# EAGLE schematic powerDistribution (EAGLE 9.5.2)
DATE: Spring'20; REVISION: 1; SCH_DESC: Measures current; Outputs to Teensy or USB; TEAM: RoboWrestling; TITLE: Current Sensing Board
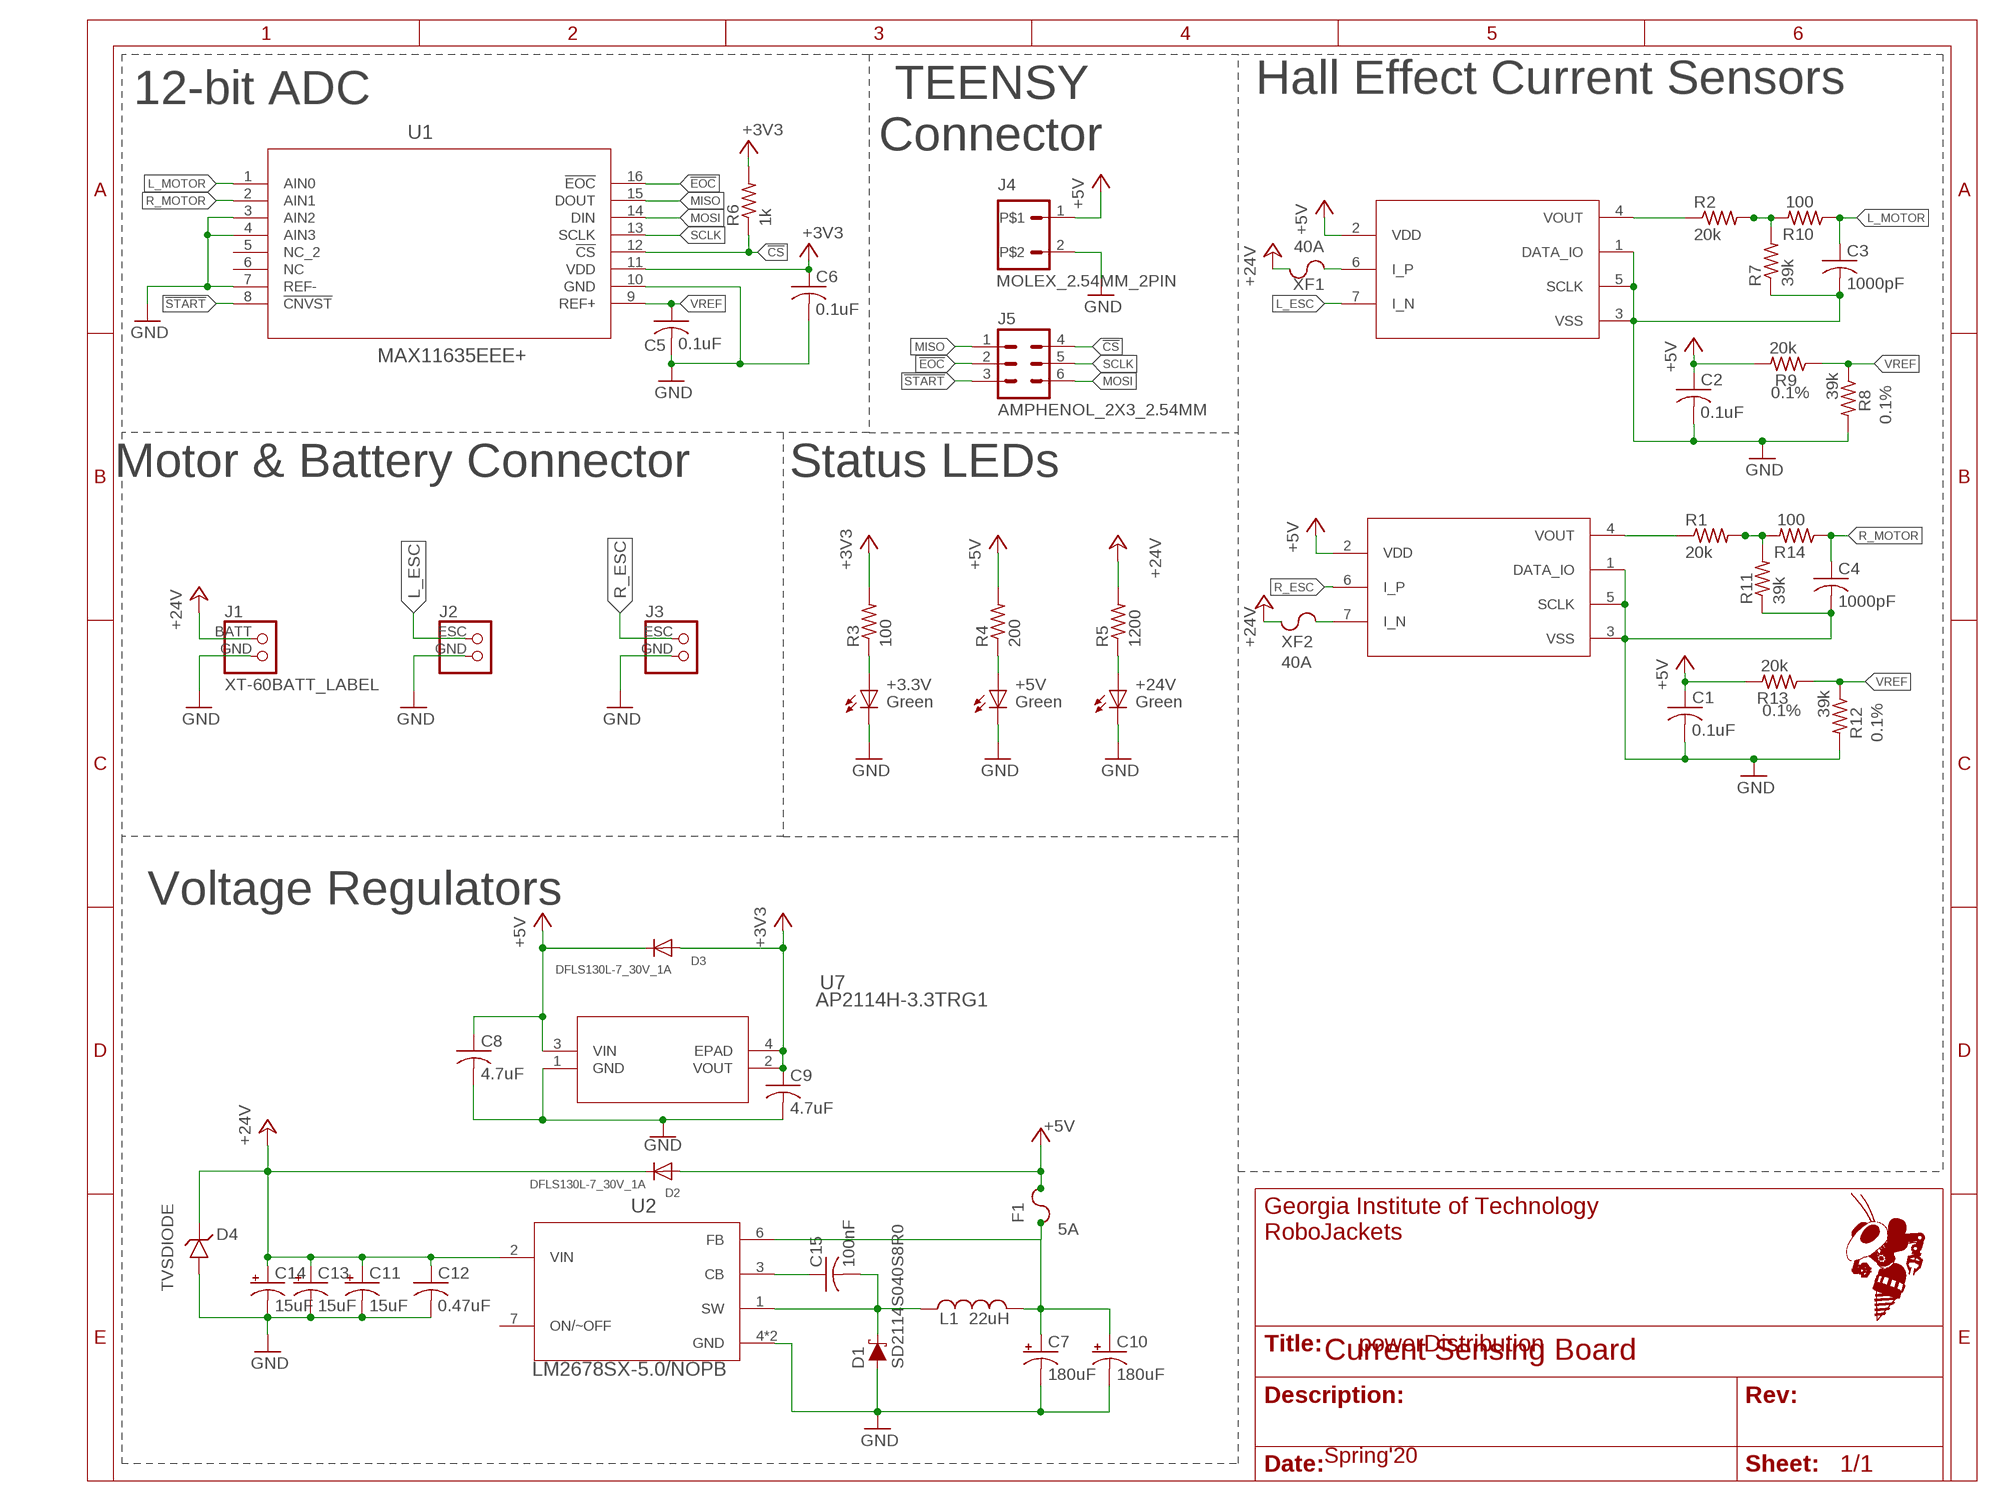
[diagram p0: schematic, sheet 1]

## Parts
+3.3V  Green  LED-SMD  [CHIP-LED0603]
+5V  Green  LED-SMD  [CHIP-LED0603]
+24V  Green  LED-SMD  [CHIP-LED0603]
C1  0.1uF  C-USC0603  [C0603]
C2  0.1uF  C-USC0603  [C0603]
C3  1000pF  C-USC0603  [C0603]
C4  1000pF  C-USC0603  [C0603]
C5  0.1uF  C-USC0603  [C0603]
C6  0.1uF  C-USC0603  [C0603]
C7  180uF  860010373009  [860010373009]
C8  4.7uF  C-USC0603  [C0603]
C9  4.7uF  C-USC0603  [C0603]
C10  180uF  860010373009  [860010373009]
C11  15uF  TR3E156M050C0300  [TR3E156M050C0300]
C12  0.47uF  C-USC0603  [C0603]
C13  15uF  TR3E156M050C0300  [TR3E156M050C0300]
C14  15uF  TR3E156M050C0300  [TR3E156M050C0300]
C15  100nF  C-USC0603  [C0603]
D1  SD2114S040S8R0  [SD2114S040S8R0]
D2  DFLS130L-7_30V_1A  [DFLS130L-7_30V_1A]
D3  DFLS130L-7_30V_1A  [DFLS130L-7_30V_1A]
D4  TVSDIODE  [TVSDIODE]
F1  5A  ERB-RE5R00V  [ERB-RE5R00V]
J1  XT-60BATT_LABEL  [XT-60]
J2  CONNECTORESC_CONNECTOR  [ESC_CONNECT]
J3  CONNECTORESC_CONNECTOR  [ESC_CONNECT]
J4  MOLEX_2.54MM_2PIN  [MOLEX_2.54MM_2PIN]
J5  AMPHENOL_2X3_2.54MM  [AMPHENOL_2X3_2.54MM]
L1  22uH  7447709220  [INDUCTOR22]
R1  20k  R-US_R0603  [R0603]
R2  20k  R-US_R0603  [R0603]
R3  100  R-US_R0603  [R0603]
R4  200  R-US_R0603  [R0603]
R5  1200  R-US_R0603  [R0603]
R6  1k  R-US_R0603  [R0603]
R7  39k  R-US_R0603  [R0603]
R8  39k  R-US_R0603  [R0603]
R9  20k  R-US_R0603  [R0603]
R10  100  R-US_R0603  [R0603]
R11  39k  R-US_R0603  [R0603]
R12  39k  R-US_R0603  [R0603]
R13  20k  R-US_R0603  [R0603]
R14  100  R-US_R0603  [R0603]
U1  MAX11635EEE+  [21-0055H_16_MXM]
U2  LM2678SX-5.0/NOPB  [TS7B]
U3  CQ2065  [974-1092-1]
U4  CQ2065  [974-1092-1]
U7  AP2114H-3.3TRG1  [SOT-223]
XF1  40A  3550(2)  [3550]
XF2  40A  3550(2)  [3550]

## Nets
!CS!: J5.4 R6.1 U1.12(!CS)
!EOC!: J5.2 U1.16(!EOC)
!START!: J5.3 U1.8(!CNVST)
+3V3: C6.1 C9.1 D3.P$2(A) R3.2 R6.2 U1.11(VDD) U7.2(VOUT) U7.4(EPAD)
+5V: C1.1 C2.1 C8.1 D2.P$2(A) D3.P$1(C) F1.2 J4.1 R4.2 R9.2 R13.2 U3.2(VDD) U4.2(VDD) U7.3(VIN)
+24V: C11.1(+) C12.1 C13.1(+) C14.1(+) D2.P$1(C) D4.P$2(C) J1.BATT R5.2 U2.2(VIN) XF1.3 XF1.4 XF2.1 XF2.2
GND: +3.3V.C(K) +5V.C(K) +24V.C(K) C1.2 C2.2 C3.2 C4.2 C5.2 C6.2 C7.2(-) C8.2 C9.2 C10.2(-) C11.2(-) C12.2 C13.2(-) C14.2(-) D1.1(A) D4.P$1(A) J1.GND J2.GND J3.GND J4.2 R7.1 R8.2 R11.1 R12.2 U1.3(AIN2) U1.4(AIN3) U1.7(REF-) U1.10(GND) U2.4(GND) U2.8(GND) U3.1(DATA_IO) U3.3(VSS) U3.5(SCLK) U4.1(DATA_IO) U4.3(VSS) U4.5(SCLK) U7.1(GND)
I1: U3.6(I_P) XF1.1 XF1.2
I2: U4.7(I_N) XF2.3 XF2.4
L_ESC: J2.ESC U3.7(I_N)
L_MOTOR: C3.1 R10.1 U1.1(AIN0)
MISO: J5.1 U1.15(DOUT)
MOSI: J5.6 U1.14(DIN)
N$1: R1.1 U4.4(VOUT)
N$2: R2.2 R7.2 R10.2
N$3: R2.1 U3.4(VOUT)
N$4: R1.2 R11.2 R14.2
N$5: +3.3V.A R3.1
N$6: C15.2 D1.2(C) L1.1 U2.1(SW)
N$7: C15.1 U2.3(CB)
N$8: +5V.A R4.1
N$9: +24V.A R5.1
N$10: C7.1(+) C10.1(+) F1.1 L1.2 U2.6(FB)
R_ESC: J3.ESC U4.6(I_P)
R_MOTOR: C4.1 R14.1 U1.2(AIN1)
SCLK: J5.5 U1.13(SCLK)
VREF: C5.1 R8.1 R9.1 R12.1 R13.1 U1.9(REF+)
Unconnected: U1.5(NC_2) U1.6(NC) U2.7(ON/~OFF)

## Notes on the sheet
- 12-bit ADC | Hall Effect Current Sensors
- TEENSY 
  Connector
- 0.1%
- 0.1%
- Motor & Battery Connector | Status LEDs
- 0.1%
- 0.1%
- Voltage Regulators

## Library data of the parts
+3.3V +5V +24V = RoboJackets-LEDs:LED-SMD
C1-C6 C8 C9 C12 C15 = rcl:C-US: CAPACITOR, American symbol; SPICEPREFIX: C
C7 C10 = CurrentSensing:860010373009
C11 C13 C14 = CurrentSensing:TR3E156M050C0300
D1 = CurrentSensing:SD2114S040S8R0
D2 D3 = Kirbi_ControlBoard:DFLS130L-7_30V_1A: DFLS130L-7_30V_1A
D4 = CurrentSensing:TVSDIODE
F1 = CurrentSensing:ERB-RE5R00V
J1 = RoboJackets-Connectors:XT-60: XT-60 Power Connector Distributor: HobbyKing <http://www.hobbyking.com/hobbyking/store/RC_PRODUCT_SEARCH.asp?strSearch=xt-60>
J2 J3 = CurrentSensing:CONNECTOR
J4 = CurrentSensing:MOLEX_2.54MM_2PIN: MOLEX_2.54MM_2PIN 1719770002 DigiKey: WM22676-ND
J5 = CurrentSensing:AMPHENOL_2X3_2.54MM
L1 = CurrentSensing:7447709220
R1-R14 = rcl:R-US_: RESISTOR, American symbol; SPICEPREFIX: R
U1 = CurrentSensing:MAX11635EEE+; BUILT_BY: EMA_UL_Team; MANUFACTURER_PART_NUMBER: MAX11635EEE+; SOURCELIBRARY: Maxim_2014-05-21; VENDOR: Maxim Integrated Products
U2 = CurrentSensing:LM2678SX-5.0/NOPB
U3 U4 = CurrentSensing:CQ2065
U7 = Gucci_ControlBoard:AP2114H-3.3TRG1; MANUFACTURER_PART_NUMBER: AP2114H3.3TRG1; VENDOR: Diodes Inc
XF1 XF2 = CurrentSensing:3550(2)